# EAGLE design Probe_Schematic (EAGLE 9.6.2)
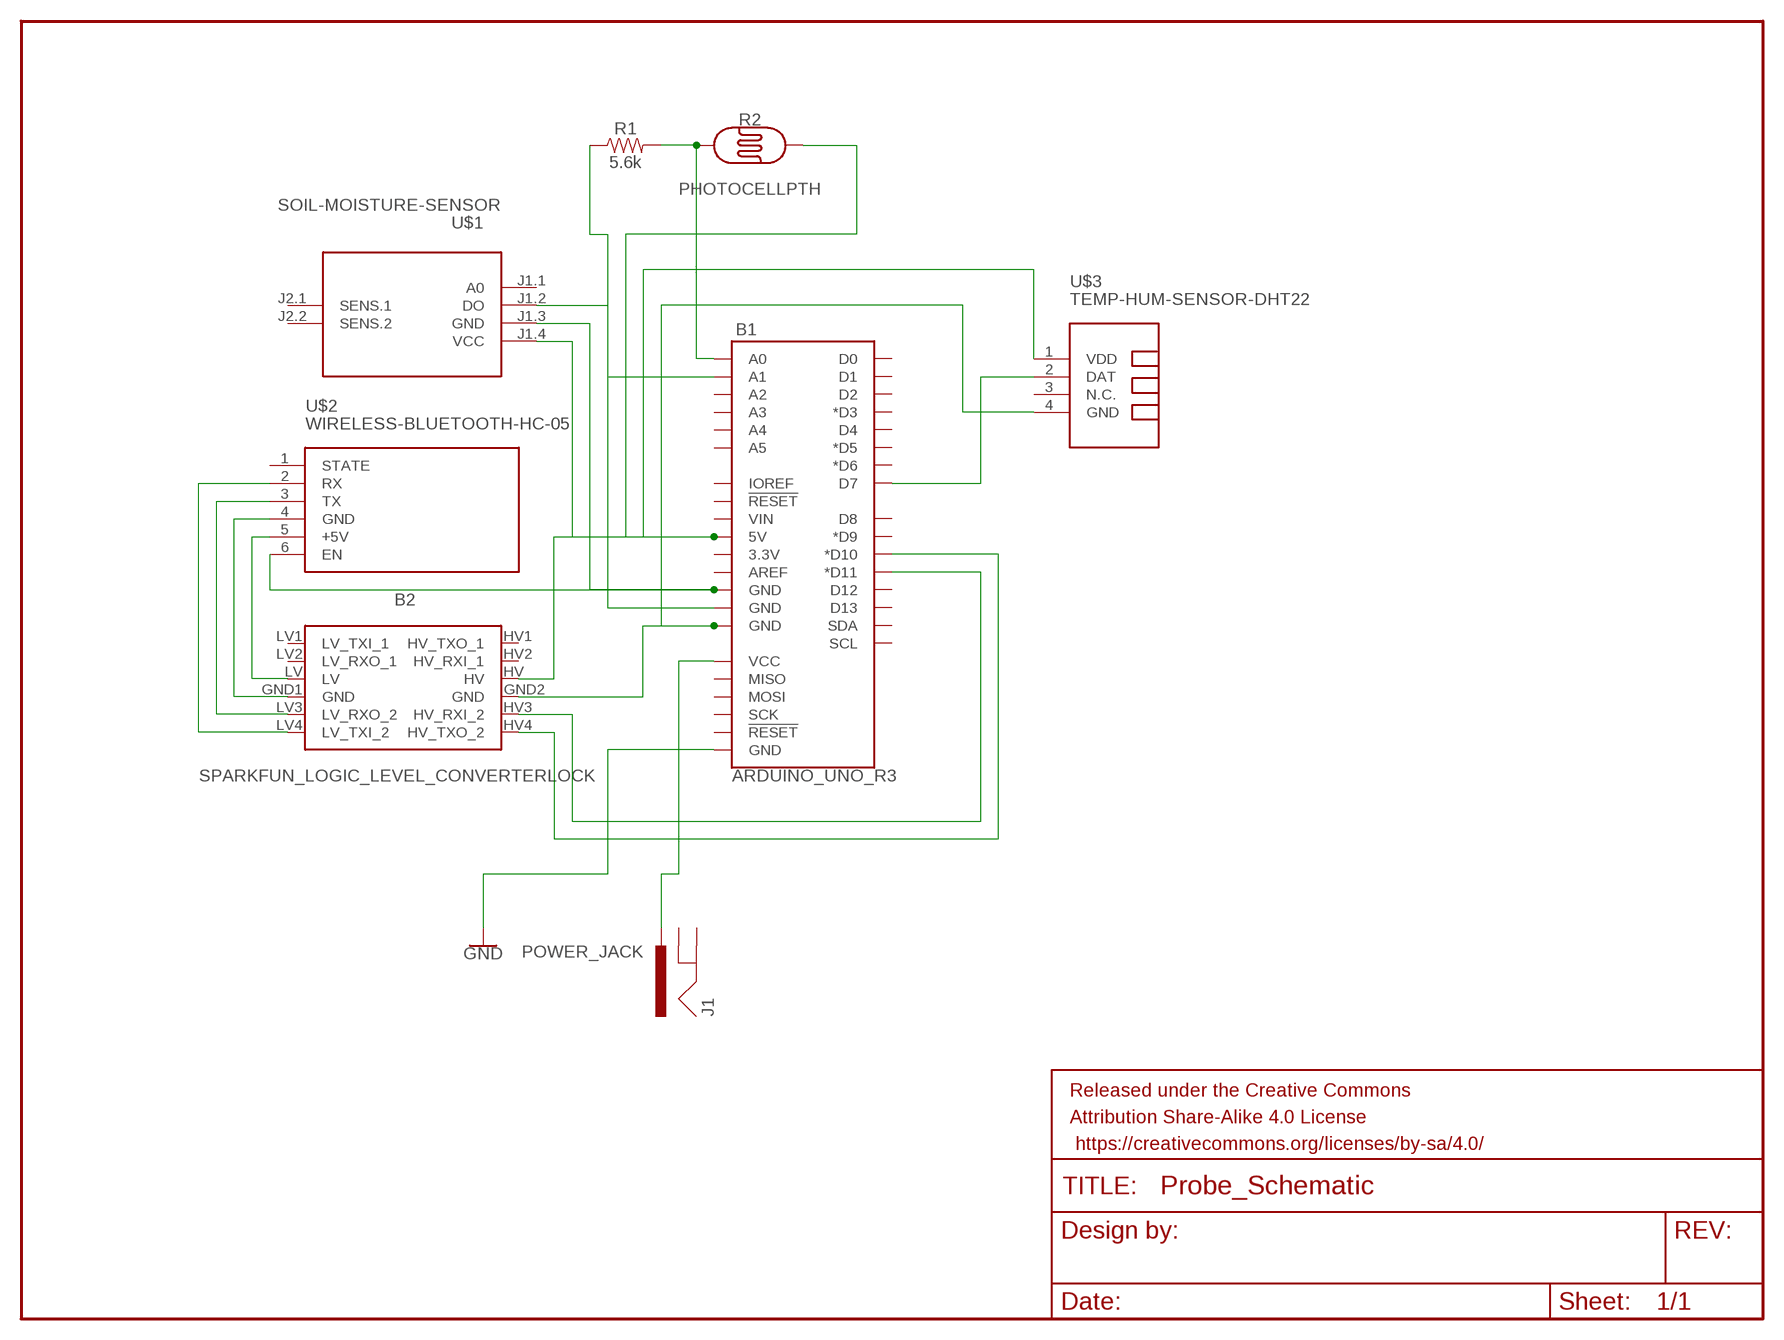
[diagram p0: schematic, sheet 1]

## Parts
B1  ARDUINO_UNO_R3  [ARDUINO_R3]
B2  SPARKFUN_LOGIC_LEVEL_CONVERTERLOCK  [SPARKFUN_LOGIC_LEVEL_CONVERTER_LOCK]
FRAME1  FRAME-LETTER  [CREATIVE_COMMONS]
J1  POWER_JACK  [POWER_JACK_PTH]
R1  5.6k  5.6KOHM-0603-1/10W-1%  [0603]
R2  PHOTOCELLPTH  [PHOTOCELL]
U$1  SOIL-MOISTURE-SENSOR  [SOIL-MOISTURE-SENSOR]
U$2  WIRELESS-BLUETOOTH-HC-05  [WIRELESS-BLUETOOTH-HC-05]
U$3  TEMP-HUM-SENSOR-DHT22  [TEMP-HUM-SENSOR-DHT22]

## Nets
GND: B1.GND@1(GND)
N$1: B1.GND@4(GND) U$1.J1.3(GND) U$2.6(EN)
N$2: B2.GND1(GND) U$2.4(GND)
N$3: B2.LV U$2.5(+5V)
N$4: B2.LV3(LV_RXO_2) U$2.3(TX)
N$5: B2.LV4(LV_TXI_2) U$2.2(RX)
N$6: B1.GND@2(GND) B2.GND2(GND) U$3.4(GND)
N$7: B1.GND@3(GND) R1.1
N$8: B1.D11(*D11) B2.HV3(HV_RXI_2)
N$9: B1.D10(*D10) B2.HV4(HV_TXO_2)
N$10: B1.D7 U$3.2(DAT)
N$11: B1.A1 U$1.J1.2(DO)
N$12: B1.VCC J1.PWR
N$13: B1.5V B2.HV R2.2 U$1.J1.4(VCC) U$3.1(VDD)
N$15: B1.A0 R1.2 R2.1
Unconnected: B1.3.3V B1.A2 B1.A3 B1.A4 B1.A5 B1.AREF B1.D0 B1.D1 B1.D2 B1.D3(*D3) B1.D4 B1.D5(*D5) B1.D6(*D6) B1.D8 B1.D9(*D9) B1.D12 B1.D13 B1.IOREF B1.MISO B1.MOSI B1.RESET@1(!RESET!) B1.RESET@2(!RESET!) B1.SCK B1.SCL B1.SDA B1.VIN B2.HV1(HV_TXO_1) B2.HV2(HV_RXI_1) B2.LV1(LV_TXI_1) B2.LV2(LV_RXO_1) J1.GND J1.GNDBREAK U$1.J1.1(A0) U$1.J2.1(SENS.1) U$1.J2.2(SENS.2) U$2.1(STATE) U$3.3(N.C.)

## Library data of the parts
B1 = SparkFun-Boards:ARDUINO_UNO_R3: Arduino R3 Footprint with SPI header Arduino Uno R3 Compatible Footprint. Matches PCB size of the original board. SparkFun Products: SAMD21 Dev Breakout <https://www.sparkfun.com/products/13672> RedBoard <https://www.sparkfun.com/products/12757> R3 Stackable Headers <https://www.sparkfun.com/products/11417>
B2 = SparkFun-Boards:SPARKFUN_LOGIC_LEVEL_CONVERTER: SparkFun Logic Level Converter -Bi-Directional This is the mechnical outline for the 3.3V - 5V bi directional logic level converter. *Note, the "LOCK" Package has the header pins staggered by an offset of 5 mils (off center line), so that when you slide a row of standard 0.1" headers into the PTH pads, it will hold position vertically. See the follwing turorial for more information on this type of special footprints: Sneaky Footprints <https://www.sparkfun.com/tutorials/114> SparkFun Products: SparkFun Logic Level Converter - Bi-Directional <https://www.sparkfun.com/products/12009>
FRAME1 = SparkFun-Aesthetics:FRAME-LETTER: Schematic Frame - Letter Standard 8.5x11 US Letter frame
J1 = SparkFun-Connectors:POWER_JACK: Power Jack Connector This is the standard 5.5mm barrel jack for power. The PTH is the most common, proven, reliable, footprint. The Slot footprint only works if the mill layer is transmitted to the PCB fab house so be warned. Here are the connectors we sell at SparkFun: DC Barrel Power Jack/Connector <https://www.sparkfun.com/products/119> (PRT-00119) DC Barrel Power Jack/Connector (SMD) <https://www.sparkfun.com/products/12748> (PRT-12748) DC Barrel Jack Adapter - Breadboard Compatible <https://www.sparkfun.com/products/10811> (PRT-10811) It is used on this SparkFun product (and many, many others): SparkFun RedBoard - Programmed with Arduino <https://www.sparkfun.com/products/12757> (DEV-12757) Also, if you need a mating power supply or connector, please check these out: Wall Adapter Power Supply - 9VDC 650mA <https://www.sparkfun.com/products/298> (TOL-00298) DC Barrel Jack Adapter - Male <https://www.sparkfun.com/products/10287> (PRT-10287); PROD_ID: CONN-08197
R1 = SparkFun-Resistors:5.6KOHM: 5.6kΩ resistor A resistor is a passive two-terminal electrical component that implements electrical resistance as a circuit element. Resistors act to reduce current flow, and, at the same time, act to lower voltage levels within circuits. - Wikipedia; PROD_ID: RES-12378
R2 = SparkFun-Sensors:PHOTOCELL: Photocell (Photodetector, Photo Resistor, CdS) This is a very small light sensor. A photocell changes (also called a photodetector, photo resistor, CdS or photoconductive cell) resistance depending on the amount of light it is exposed to. These little sensors make great ambient light triggers (when light in the room turns on, do something). Datasheet <http://cdn.sparkfun.com/datasheets/Sensors/LightImaging/SEN-09088.pdf> SparkFun Products Mini Photocell <https://www.sparkfun.com/products/9088> (SEN-09088); PROD_ID: COMP-09129; SF_ID: SEN-09088
U$1 = diy-modules:SOIL-MOISTURE-SENSOR: Soil Moisture Sensor Click here to find device on ebay.com <http://www.ebay.com/sch/soil+moisture+sensor+arduino>
U$2 = diy-modules:WIRELESS-BLUETOOTH-HC-05: Bluetooth Transceiver Module based on HC-05 board Tutorial is available here: https://arduino-info.wikispaces.com/BlueTooth-HC05-HC06-Modules-How-To Click here to find device on ebay.com <http://www.ebay.com/sch/hc-05+module+rs232>
U$3 = diy-modules:TEMP-HUM-SENSOR-DHT22: DHT22 - digital humidity & temperature sensor Also known as: AM2302 AM2302 datasheet available here: http://akizukidenshi.com/download/ds/aosong/AM2302.pdf Click here to find device on ebay.com <http://www.ebay.com/sch/dht22+digital+sensor>

## Board
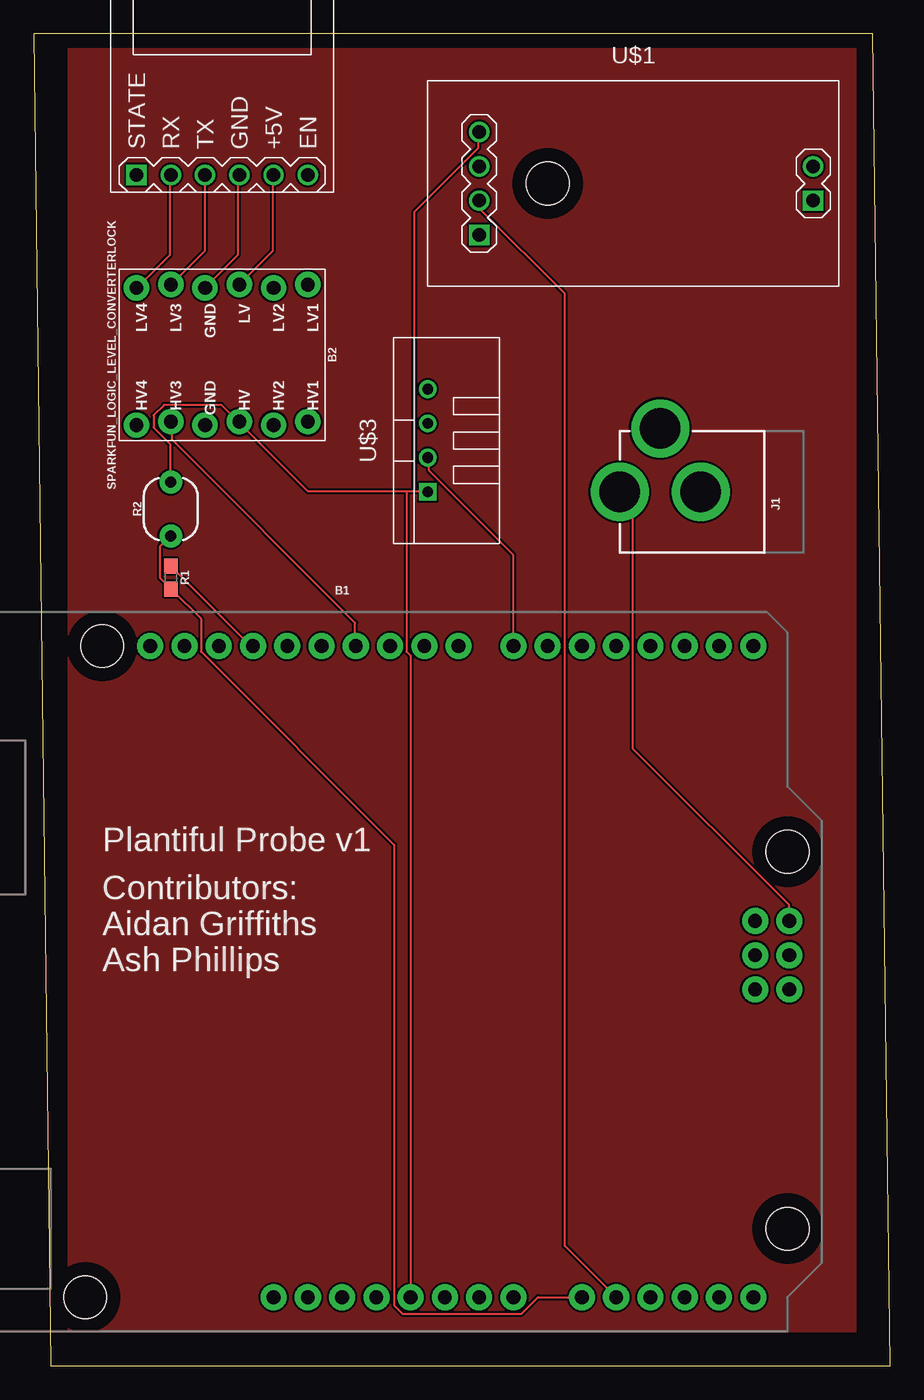
[diagram p1: board, top side]
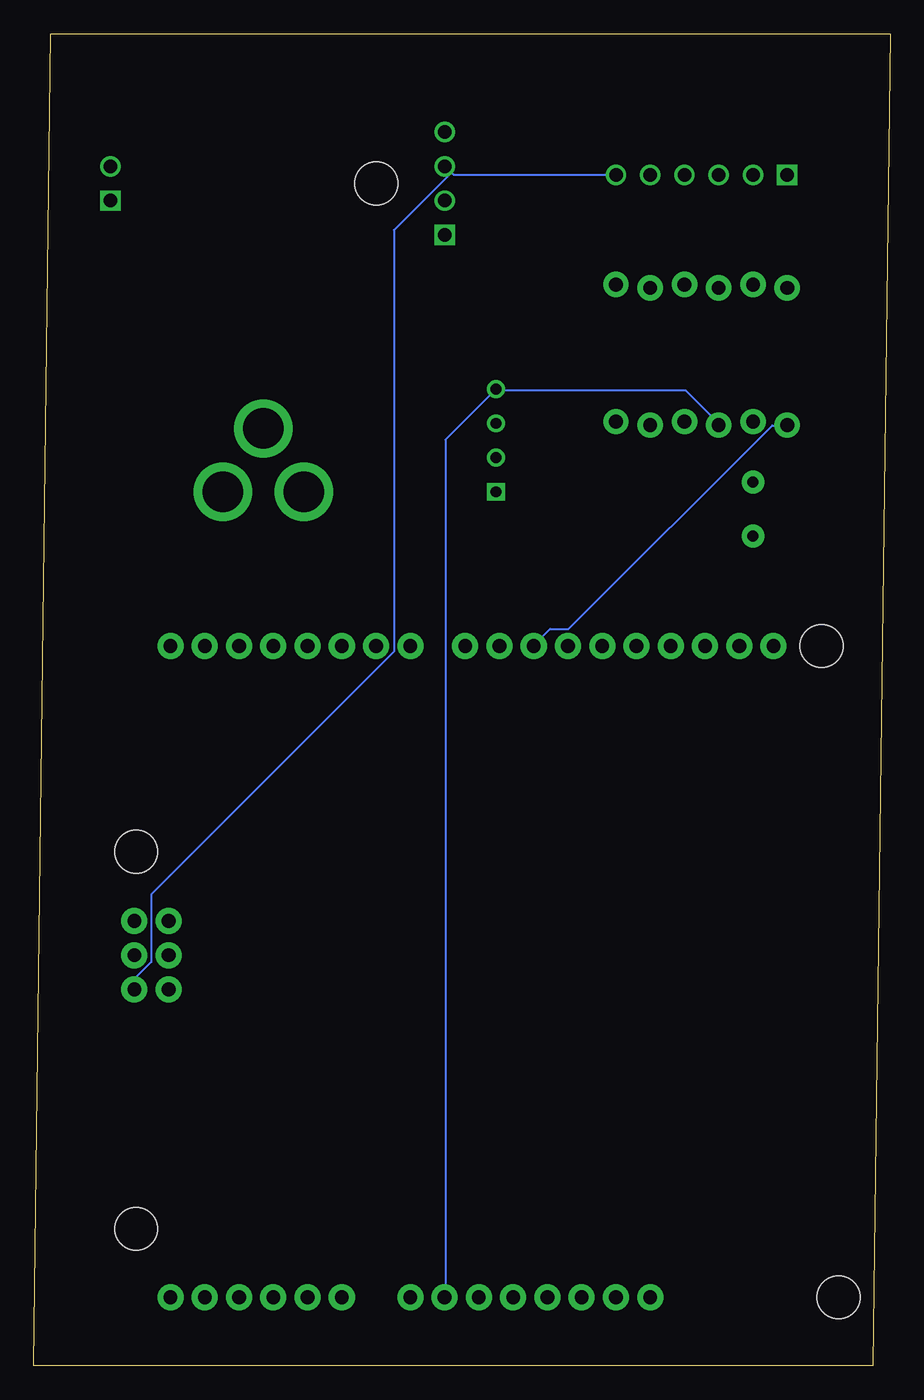
[diagram p2: board, bottom side, seen from below]

Size 63.48 x 98.73 mm. Coordinates in mm from the lower left corner, seen from the top.
Outline: 1.27,0 63.48,0 62.21,98.73 0,98.73 1.27,0
Copper layers (1*16): Top 0.035mm / dielectric 1.5mm / Bottom 0.035mm
Design rules "default": minimum track width 6mil, minimum drill 0.35mm, track to track 6mil, track to pad 6mil, pad to pad 6mil, via to via 6mil, smd to smd 6mil, copper to edge 40mil, drill to drill 6mil, minimum pad ring 10mil, minimum via ring 8mil, stop-mask expansion 4mil, vias tented up to drill 0mil, thermal gap 10mil

### Footprints (pad centres in the part's own frame; a part is rotated, then mirrored left to right if it is on the bottom)
ARDUINO_R3 = drill 1.016 pad 1.93: 3.3V 2.54,-24.13; 5V 5.08,-24.13; A0 17.78,-24.13; A1 20.32,-24.13; A2 22.86,-24.13; A3 25.4,-24.13; A4 27.94,-24.13; A5 30.48,-24.13; AREF -9.144,24.13; D0 30.48,24.13; D1 27.94,24.13; D2 25.4,24.13; D3 22.86,24.13; D4 20.32,24.13; D5 17.78,24.13; D6 15.24,24.13; D7 12.7,24.13; D8 8.636,24.13; D9 6.096,24.13; D10 3.556,24.13; D11 1.016,24.13; D12 -1.524,24.13; D13 -4.064,24.13; GND@1 7.62,-24.13; GND@2 10.16,-24.13; GND@3 -6.604,24.13; GND@4 33.16,-1.32; IOREF -2.54,-24.13; MISO 30.62,3.76; MOSI 33.16,1.22; NC -5.08,-24.13; RESET@1 0,-24.13; RESET@2 30.62,-1.32; SCK 30.62,1.22; SCL -14.224,24.13; SDA -11.684,24.13; VCC 33.16,3.76; VIN 12.7,-24.13 | hole 3.175: -17.78,24.13; 33.02,8.89; 33.02,-19.05; -19.05,-24.13
SPARKFUN_LOGIC_LEVEL_CONVERTER_LOCK = drill 1.016 pad 1.88: GND1 -4.953,-1.27; GND2 5.207,-1.27; HV 4.953,1.27; HV1 4.953,6.35; HV2 5.207,3.81; HV3 4.953,-3.81; HV4 5.207,-6.35; LV -5.207,1.27; LV1 -5.207,6.35; LV2 -4.953,3.81; LV3 -5.207,-3.81; LV4 -4.953,-6.35
POWER_JACK_PTH = drill 2.997 pad 4.318: GND 0,7.7; GNDBREAK 4.7,10.7; PWR 0,13.7
0603 = smd 1.1 x 1: 1 -0.85,0; 2 0.85,0
PHOTOCELL = drill 0.8 pad 1.676: 1 -2,0; 2 2,0
SOIL-MOISTURE-SENSOR = drill 1 square: J1.1 -11.43,-3.81; J2.1 13.335,-1.27 | drill 1: J1.2 -11.43,-1.27; J1.3 -11.43,1.27; J1.4 -11.43,3.81; J2.2 13.335,1.27 | hole 3.2: -6.35,0
WIRELESS-BLUETOOTH-HC-05 = drill 1 square: 1 -6.35,-17.145 | drill 1: 2 -3.81,-17.145; 3 -1.27,-17.145; 4 1.27,-17.145; 5 3.81,-17.145; 6 6.35,-17.145
TEMP-HUM-SENSOR-DHT22 = drill 0.8 square: 1 -3.81,0 | drill 0.8: 2 -1.27,0; 3 1.27,0; 4 3.81,0

### Placement (x,y rotation side)
B1  22.86,29.21 0 top
B2  13.97,74.93 270 top
FRAME1  -78.74,115.57 0 top  (outside the outline)
J1  57.15,64.77 90 top
R1  10.16,58.42 270 top
R2  10.16,63.5 90 top
U$1  44.45,87.63 0 top
U$2  13.97,105.41 0 top
U$3  29.21,68.58 90 top

### Tracks (layer width: path | path; a pad name or v marks a point on that pad's centre or on a via)
COPPER
  pour Top (isolate 0): 60.96,2.54 60.96,97.79 2.54,97.79 2.54,2.54
N$1
  Bottom 0.152: 32.51,88.44 32.97,88.9 U$1.J1.3 32.51,88.44 | 32.51,88.44 32.36,88.29 20.32,88.29 U$2.6 | 32.51,88.44 36.78,84.18 36.78,52.93 54.76,34.95 54.76,29.92 55.98,28.7 55.98,27.94 B1.GND@4
N$2
  Top 0.152: U$2.4 15.14,88.14 15.14,82.35 12.7,79.91 B2.GND1
N$3
  Top 0.152: U$2.5 17.73,88.14 17.73,82.65 15.29,80.21 B2.LV
N$4
  Top 0.152: U$2.3 12.7,82.65 10.26,80.21 B2.LV3
N$5
  Top 0.152: U$2.2 10.11,88.14 10.11,82.35 7.67,79.91 B2.LV4
N$6
  Bottom 0.152: B2.GND2 12.7,69.85 15.14,72.29 29.16,72.29 U$3.4 32.97,68.63 32.97,5.08 B1.GND@2
N$7
  Top 0.152: R1.1 10.26,59.18 16.21,53.24 B1.GND@3
N$8
  Top 0.152: B2.HV3 10.26,69.85 10.26,68.63 23.82,55.07 23.82,53.39 B1.D11
N$9
  Bottom 0.152: B2.HV4 7.67,69.7 8.74,69.7 23.82,54.61 25.2,54.61 26.42,53.39 B1.D10
N$10
  Top 0.152: B1.D7 35.56,60.1 29.31,66.34 29.31,67.26 U$3.2
N$11
  Top 0.152: B1.A1 39.37,8.89 39.37,79.45 33.12,85.7 33.12,86.31 U$1.J1.2
N$12
  Top 0.152: B1.VCC 55.98,33.12 55.98,34.19 44.4,45.77 44.4,63.75 43.49,64.67 J1.PWR
N$13
  Top 0.152: 27.63,64.82 20.32,64.82 15.29,69.85 B2.HV 15.14,70 13.92,71.22 9.65,71.22 8.89,70.46 8.89,69.54 10.11,68.33 10.11,65.58 R2.2 | 27.63,64.82 28.25,64.82 | 28.25,64.82 29.16,64.82 U$3.1 | 28.25,64.82 28.25,85.55 32.97,90.27 32.97,91.34 U$1.J1.4 | B1.5V 27.94,52.63 27.63,52.93 27.63,64.82
N$15
  Top 0.152: R2.1 10.11,61.47 9.35,60.71 9.35,58.42 10.11,57.66 R1.2 10.26,57.51 12.39,55.37 12.39,52.93 26.72,38.61 26.72,4.47 27.33,3.86 36.17,3.86 37.39,5.08 B1.A0

### Text on the board
tPlace: Plantiful Probe v1 | Contributors: / Aidan Griffiths / Ash Phillips